# EAGLE design 2025-03-07_main_board (EAGLE 9.6.2)

## Sheet 1 of 2
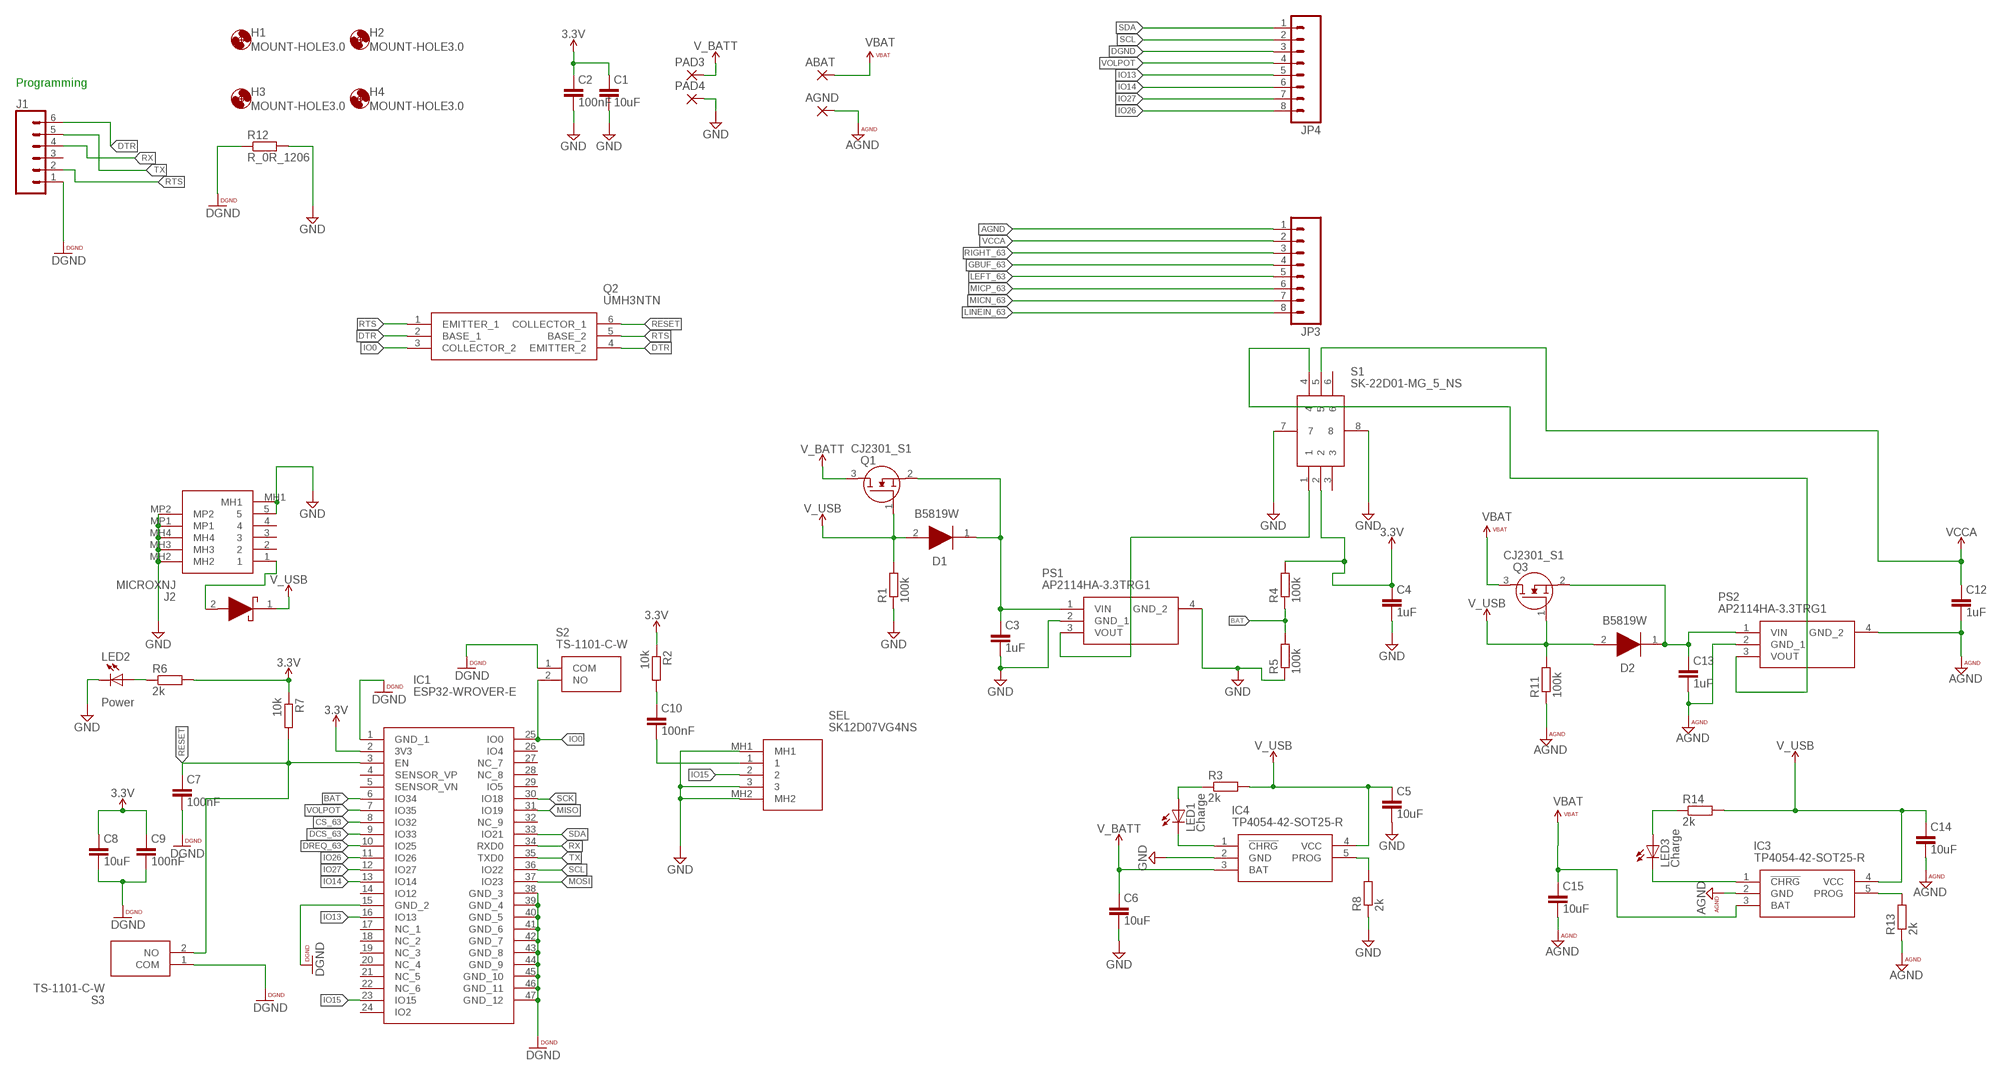
[diagram p0: schematic, sheet 1, part 1 of 2]
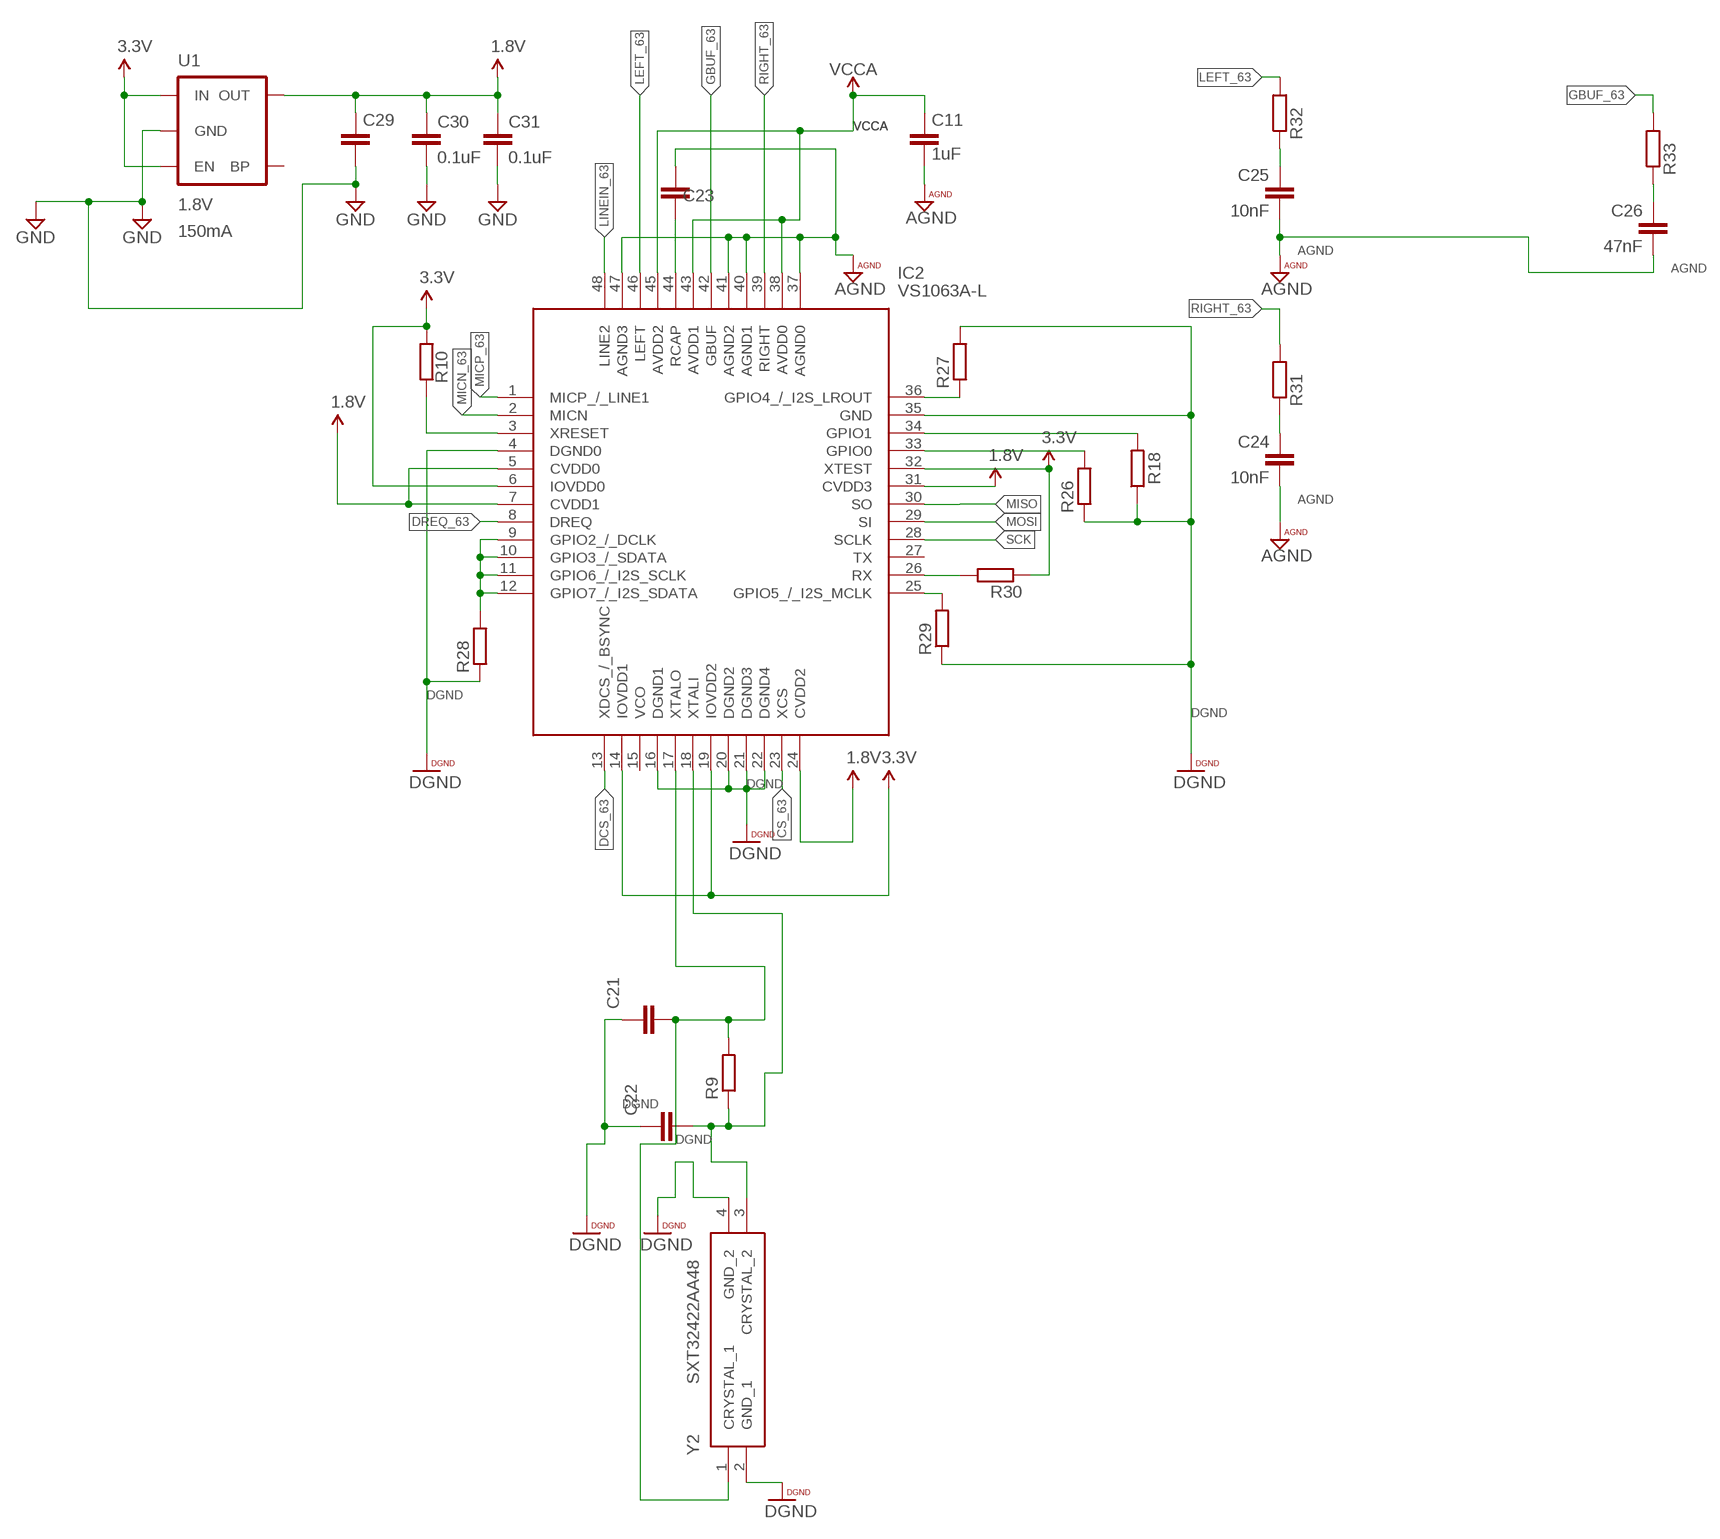
[diagram p1: schematic, sheet 1, part 2 of 2]

### Parts
ABAT  2,54/0,8  [2,54/0,8]
AGND  2,54/0,8  [2,54/0,8]
C1  10uF  C_10UF/25V_0603  [C0603]
C2  100nF  C_100NF/50V_0603  [C0603]
C3  1uF  C_1UF/25V_0402  [C0402]
C4  1uF  C_1UF/25V_0402  [C0402]
C5  10uF  C_10UF/25V_0603  [C0603]
C6  10uF  C_10UF/25V_0603  [C0603]
C7  100nF  C_100NF/50V_0603  [C0603]
C8  10uF  C_10UF/25V_0603  [C0603]
C9  100nF  C_100NF/50V_0603  [C0603]
C10  100nF  C_100NF/50V_0603  [C0603]
C11  1uF  C_1UF/25V_0402  [C0402]
C12  1uF  C_1UF/25V_0402  [C0402]
C13  1uF  C_1UF/25V_0402  [C0402]
C14  10uF  C_10UF/25V_0603  [C0603]
C15  10uF  C_10UF/25V_0603  [C0603]
C21  22pF  C_12PF/50V_0603  [C0603]
C22  22pF  C_12PF/50V_0603  [C0603]
C23  1.0uF  C_1UF/25V_0402  [C0402]
C24  10nF  10NF/10000PF-50V-10%(0603)  [0603-CAP]
C25  10nF  10NF/10000PF-50V-10%(0603)  [0603-CAP]
C26  47nF  47NF(0.047UF/47000PF)-25V-5%(0603)SMD  [0603-CAP]
C29  10uF  C_10UF/25V_0603  [C0603]
C30  0.1uF  0.1UF-25V(+80/-20%)(0603)  [0603-CAP]
C31  0.1uF  0.1UF-25V(+80/-20%)(0603)  [0603-CAP]
D1  B5819W  [SOD3716X125N]
D2  B5819W  [SOD3716X125N]
D5  BAT760-7  [SOD2513X120N]
H1  MOUNT-HOLE3.0  [3,0]
H2  MOUNT-HOLE3.0  [3,0]
H3  MOUNT-HOLE3.0  [3,0]
H4  MOUNT-HOLE3.0  [3,0]
IC1  ESP32-WROVER-E  [ESP32WROVERE]
IC2  VS1063A-L  [QFP50P900X900X160-48N]
IC3  TP4054-42-SOT25-R  [SOT95P280X100-5N]
IC4  TP4054-42-SOT25-R  [SOT95P280X100-5N]
J1  CONN_06NO_SILK_FEMALE_PTH  [1X06_NO_SILK]
J2  MICROXNJ  [MICROXNJ]
JP3  M08  [1X08_ROUND]
JP4  M08  [1X08_ROUND]
LED1  Charge  LEDCHIP-LED0603  [CHIP-LED0603]
LED2  Power  LEDCHIP-LED0603  [CHIP-LED0603]
LED3  Charge  LEDCHIP-LED0603  [CHIP-LED0603]
PAD3  2,54/0,8  [2,54/0,8]
PAD4  2,54/0,8  [2,54/0,8]
PS1  AP2114HA-3.3TRG1  [SOT230P700X180-4N]
PS2  AP2114HA-3.3TRG1  [SOT230P700X180-4N]
Q1  CJ2301_S1  [SOT95P240X115-3N]
Q2  UMH3NTN  [UMH3NTN]
Q3  CJ2301_S1  [SOT95P240X115-3N]
R1  100k  R_100K_0603  [R0603]
R2  10k  R_10K_0603  [R0603]
R3  2k  R_2K_0603  [R0603]
R4  100k  R_100K_0603  [R0603]
R5  100k  R_100K_0603  [R0603]
R6  2k  R_2K_0603  [R0603]
R7  10k  R_10K_0603  [R0603]
R8  2k  R_2K_0603  [R0603]
R9  1M  R_1M_0603  [R0603]
R10  100k  R_100K_0603  [R0603]
R11  100k  R_100K_0603  [R0603]
R12  R_0R_1206  [R1206]
R13  2k  R_2K_0603  [R0603]
R14  2k  R_2K_0603  [R0603]
R18  100k  R_100K_0603  [R0603]
R26  100k  R_100K_0603  [R0603]
R27  100k  R_100K_0603  [R0603]
R28  100k  R_100K_0603  [R0603]
R29  100k  R_100K_0603  [R0603]
R30  100k  R_100K_0603  [R0603]
R31  20  R_20R_0603  [R0603]
R32  20  R_20R_0603  [R0603]
R33  10  R_10R_0603  [R0603]
S1  SK-22D01-MG_5_NS  [SK22D01MG5NS]
S2  TS-1101-C-W  [TS1101CW]
S3  TS-1101-C-W  [TS1101CW]
SEL  SK12D07VG4NS  [SK12D07VG4NS]
U1  1.8V  V_REG_SP62141.8V  [SC70]
Y2  SXT32422AA48  [SXT32422AA48]

### Nets
1.8V: C29.1 C30.1 C31.1 IC2.5(CVDD0) IC2.7(CVDD1) IC2.24(CVDD2) IC2.31(CVDD3) U1.5(OUT)
3.3V: C1.1 C2.1 C4.1 C8.1 C9.1 IC1.2(3V3) IC2.6(IOVDD0) IC2.14(IOVDD1) IC2.19(IOVDD2) IC2.32(XTEST) R2.1 R4.2 R6.2 R7.1 R10.2 R30.1 S1.2 U1.1(IN) U1.3(EN)
AGND: AGND.1(P) C11.2 C12.2 C13.2 C14.2 C15.2 C23.2 C24.2 C25.2 C26.2 IC2.37(AGND0) IC2.40(AGND1) IC2.41(AGND2) IC2.47(AGND3) IC3.2(GND) JP3.1 PS2.2(GND_1) PS2.4(GND_2) R11.1 R13.1
BAT: IC1.6(IO34) R4.1 R5.2
CS_63: IC1.8(IO32) IC2.23(XCS)
DCS_63: IC1.9(IO33) IC2.13(XDCS_/_BSYNC)
DGND: C7.2 C8.2 C9.2 C21.1 C22.1 IC1.1(GND_1) IC1.15(GND_2) IC1.38(GND_3) IC1.39(GND_4) IC1.40(GND_5) IC1.41(GND_6) IC1.42(GND_7) IC1.43(GND_8) IC1.44(GND_9) IC1.45(GND_10) IC1.46(GND_11) IC1.47(GND_12) IC2.4(DGND0) IC2.16(DGND1) IC2.20(DGND2) IC2.21(DGND3) IC2.22(DGND4) IC2.35(GND) J1.1 JP4.3 R12.1 R18.1 R26.1 R27.2 R28.1 R29.1 S2.1(COM) S3.1(COM) Y2.2(GND_1) Y2.4(GND_2)
DREQ_63: IC1.10(IO25) IC2.8(DREQ)
DTR: J1.6 Q2.2(BASE_1) Q2.4(EMITTER_2)
GBUF_63: IC2.42(GBUF) JP3.4 R33.2
GND: C1.2 C2.2 C3.2 C4.2 C5.2 C6.2 C29.2 C30.2 C31.2 IC4.2(GND) J2.5 J2.MH1 J2.MH2 J2.MH3 J2.MH4 J2.MP1 J2.MP2 LED2.C PAD4.1(P) PS1.2(GND_1) PS1.4(GND_2) R1.1 R5.1 R8.1 R12.2 S1.7 S1.8 SEL.3 SEL.MH1 SEL.MH2 U1.2(GND)
IO0: IC1.25(IO0) Q2.3(COLLECTOR_2) S2.2(NO)
IO13: IC1.16(IO13) JP4.5
IO14: IC1.13(IO14) JP4.6
IO15: IC1.23(IO15) SEL.2
IO26: IC1.11(IO26) JP4.8
IO27: IC1.12(IO27) JP4.7
LEFT_63: IC2.46(LEFT) JP3.5 R32.2
LINEIN_63: IC2.48(LINE2) JP3.8
MICN_63: IC2.2(MICN) JP3.7
MICP_63: IC2.1(MICP_/_LINE1) JP3.6
MISO: IC1.31(IO19) IC2.30(SO)
MOSI: IC1.37(IO23) IC2.29(SI)
N$1: PS1.3(VOUT) S1.1
N$2: C3.1 D1.1(K) PS1.1(VIN) Q1.2(S)
N$3: LED2.A R6.1
N$4: IC4.1(!CHRG) LED1.C
N$5: LED1.A R3.1
N$6: D5.2(A) J2.1
N$7: IC4.5(PROG) R8.2
N$8: C13.1 D2.1(K) PS2.1(VIN) Q3.2(S)
N$9: C10.1 R2.2
N$10: C10.2 SEL.1
N$11: IC2.3(XRESET) R10.1
N$12: IC2.34(GPIO1) R18.2
N$14: IC3.1(!CHRG) LED3.C
N$16: LED3.A R14.1
N$17: PS2.3(VOUT) S1.4
N$20: C21.2 IC2.17(XTALO) R9.2 Y2.1(CRYSTAL_1)
N$21: IC2.36(GPIO4_/_I2S_LROUT) R27.1
N$22: IC2.33(GPIO0) R26.2
N$23: C22.2 IC2.18(XTALI) R9.1 Y2.3(CRYSTAL_2)
N$24: C23.1 IC2.44(RCAP)
N$25: IC2.25(GPIO5_/_I2S_MCLK) R29.2
N$26: IC3.5(PROG) R13.2
N$27: IC2.9(GPIO2_/_DCLK) IC2.10(GPIO3_/_SDATA) IC2.11(GPIO6_/_I2S_SCLK) IC2.12(GPIO7_/_I2S_SDATA) R28.2
N$28: IC2.26(RX) R30.2
N$30: C26.1 R33.1
N$31: C25.1 R32.1
N$32: C24.1 R31.1
RESET: C7.1 IC1.3(EN) Q2.6(COLLECTOR_1) R7.2 S3.2(NO)
RIGHT_63: IC2.39(RIGHT) JP3.3 R31.2
RTS: J1.2 Q2.1(EMITTER_1) Q2.5(BASE_2)
RX: IC1.34(RXD0) J1.4
SCK: IC1.30(IO18) IC2.28(SCLK)
SCL: IC1.36(IO22) JP4.2
SDA: IC1.33(IO21) JP4.1
TX: IC1.35(TXD0) J1.5
V_BATT: C6.1 IC4.3(BAT) PAD3.1(P) Q1.3(D)
V_USB: C5.1 C14.1 D1.2(A) D2.2(A) D5.1(K) IC3.4(VCC) IC4.4(VCC) Q1.1(G) Q3.1(G) R1.2 R3.2 R11.2 R14.2
VBAT: ABAT.1(P) C15.1 IC3.3(BAT) Q3.3(D)
VCCA: C11.1 C12.1 IC2.38(AVDD0) IC2.43(AVDD1) IC2.45(AVDD2) JP3.2 S1.5
VOLPOT: IC1.7(IO35) JP4.4
Unconnected: IC1.4(SENSOR_VP) IC1.5(SENSOR_VN) IC1.14(IO12) IC1.17(NC_1) IC1.18(NC_2) IC1.19(NC_3) IC1.20(NC_4) IC1.21(NC_5) IC1.22(NC_6) IC1.24(IO2) IC1.26(IO4) IC1.27(NC_7) IC1.28(NC_8) IC1.29(IO5) IC1.32(NC_9) IC2.15(VCO) IC2.27(TX) J1.3 J2.2 J2.3 J2.4 S1.3 S1.6 U1.4(BP)

### Notes on the sheet
- Programming
- 150mA

## Sheet 2 of 2

## Library data of the parts
ABAT AGND PAD3 PAD4 = wirepad:2,54/0,8: THROUGH-HOLE PAD
C1 C5 C6 C8 C14 C15 C29 = JLC PCB Basic Parts_loc:C_: Capacitor General purpose SMD Capacitor; LCSC_DATASHEET: https://datasheet.lcsc.com/lcsc/1811110921_Samsung-Electro-Mechanics-CL10A106MA8NRNC_C96446.pdf; LCSC_PART: C96446; LCSC_ROTATION_CCW: 0; LCSC_STOCK: 119091; PROPERTIES: X5R 25V ±20% 10uF 0603 ROHS
C2 C7 C9 C10 = JLC PCB Basic Parts_loc:C_: Capacitor General purpose SMD Capacitor; LCSC_DATASHEET: https://datasheet.lcsc.com/lcsc/1809301912_YAGEO-CC0603KRX7R9BB104_C14663.pdf; LCSC_PART: C14663; LCSC_ROTATION_CCW: 0; LCSC_STOCK: 7111530; PROPERTIES: 50V 100nF X7R ±10% 0603 ROHS
C3 C4 C11-C13 C23 = JLC PCB Basic Parts_loc:C_: Capacitor General purpose SMD Capacitor; LCSC_DATASHEET: https://datasheet.lcsc.com/lcsc/1811091611_Samsung-Electro-Mechanics-CL05A105KA5NQNC_C52923.pdf; LCSC_PART: C52923; LCSC_ROTATION_CCW: 0; LCSC_STOCK: 6404174; PROPERTIES: 25V 1uF X5R ±10% 0402 ROHS
C21 C22 = JLC PCB Basic Parts_loc:C_: Capacitor General purpose SMD Capacitor; LCSC_DATASHEET: https://datasheet.lcsc.com/lcsc/1810261515_Samsung-Electro-Mechanics-CL10C120JB8NNNC_C38523.pdf; LCSC_PART: C38523; LCSC_ROTATION_CCW: 0; LCSC_STOCK: 87030; PROPERTIES: 50V 12pF C0G ±5% 0603 ROHS
C24 C25 = SparkFun-Capacitors:10NF/10000PF-50V-10%(0603): CAP-00867; PROD_ID: CAP-00867
C26 = SparkFun-Capacitors:47NF(0.047UF/47000PF)-25V-5%(0603): CAP-08605; PROD_ID: CAP-08605
C30 C31 = SparkFun-Capacitors:0.1UF-25V(+80/-20%)(0603): CAP-00810 Ceramic Standard decoupling cap; PROD_ID: CAP-00810
D1 D2 = B5819W:B5819W: 40V 1A 600mV @ 1A SOD-123 Schottky Barrier Diodes (SBD) Source: Datasheet; DESCRIPTION: 40V 1A 600mV @ 1A SOD-123 Schottky Barrier Diodes (SBD); HEIGHT: 1.25mm; MANUFACTURER_NAME: Changjiang Electronics Tech (CJ); MANUFACTURER_PART_NUMBER: B5819W
D5 = BAT760-7:BAT760-7: Diode Schottky 30V 1A 2Pin SOD323 Diodes Inc BAT760-7, SMT Schottky Diode, 30V 1A, 2-Pin SOD-323 Source: Datasheet; ARROW_PART_NUMBER: BAT760-7; ARROW_PRICE-STOCK: https://www.arrow.com/en/products/bat760-7/diodes-incorporated?region=europe; DESCRIPTION: Diode Schottky 30V 1A 2Pin SOD323 Diodes Inc BAT760-7, SMT Schottky Diode, 30V 1A, 2-Pin SOD-323; HEIGHT: 1.2mm; MANUFACTURER_NAME: Diodes Inc.; MANUFACTURER_PART_NUMBER: BAT760-7; MOUSER_PART_NUMBER: 621-BAT760-7; MOUSER_PRICE-STOCK: https://www.mouser.co.uk/ProductDetail/Diodes-Incorporated/BAT760-7?qs=JV7lzlMm3yKDDyO09xoRbQ%3D%3D
H1-H4 = holes:MOUNT-HOLE: MOUNTING HOLE with drill center marker
IC1 = ESP32-WROVER-E:ESP32-WROVER-E: Module: IoT; Bluetooth Low Energy,WiFi; PCB; SMD; 18x31.4x3.3mm Source: Datasheet; DESCRIPTION: Module: IoT; Bluetooth Low Energy,WiFi; PCB; SMD; 18x31.4x3.3mm; HEIGHT: 3.45mm; MANUFACTURER_NAME: Espressif Systems; MANUFACTURER_PART_NUMBER: ESP32-WROVER-E
IC2 = VS1063A-L:VS1063A-L: VS1063 - MP3 / Ogg Vorbis Encoder and Audio Codec Circuit, LQFP48 7x7x1.4mm Source: Datasheet; DESCRIPTION: VS1063 - MP3 / Ogg Vorbis Encoder and Audio Codec Circuit, LQFP48 7x7x1.4mm; HEIGHT: 1.6mm; MANUFACTURER_NAME: VLSI; MANUFACTURER_PART_NUMBER: VS1063A-L
IC3 IC4 = TP4054-42-SOT25-R:TP4054-42-SOT25-R: Standalone Linear Li-ion Battery Charger with Thermal Regulation, SOT-23-5 Source: Datasheet; DESCRIPTION: Standalone Linear Li-ion Battery Charger with Thermal Regulation, SOT-23-5; HEIGHT: 1mm; MANUFACTURER_NAME: TOP POWER; MANUFACTURER_PART_NUMBER: TP4054-42-SOT25-R
J1 = SparkFun-Connectors:CONN_06: Multi connection point. Often used as Generic Header-pin footprint for 0.1 inch spaced/style header connections On any of the 0.1 inch spaced packages, you can populate with these: Break Away Headers - Straight (PRT-00116) Break Away Male Headers - Right Angle (PRT-00553) Female Headers (PRT-00115) Break Away Headers - Machine Pin (PRT-00117) Break Away Female Headers - Swiss Machine Pin (PRT-00743) Arduino Stackable Header - 6 Pin (PRT-09280) For SCREWTERMINALS and SPRING TERMINALS visit here: Screw Terimnals on SparkFun.com (5mm/3.5mm/2.54mm spacing) This device is also useful as a general connection point to wire up your design to another part of your project. Our various solder wires solder well into these plated through hole pads. Hook-Up Wire - Assortment (Stranded, 22 AWG) (PRT-11375) Hook-Up Wire - Assortment (Solid Core, 22 AWG) (PRT-11367) View the entire wire category on our website here; PROD_ID: CONN-08437
J2 = MICROXNJ:MICROXNJ: MICRO-USB-SMD_MICROXNJ Source: Datasheet; DESCRIPTION: MICRO-USB-SMD_MICROXNJ; HEIGHT: 2.425mm; MANUFACTURER_NAME: Shou Han; MANUFACTURER_PART_NUMBER: MICROXNJ
JP3 JP4 = PatternAgents-ProtoPads:M08: Header 8 Standard 8-pin 0.1" header
LED1-LED3 = adafruit:LED: LED OSRAM: - CHIPLED LG R971, LG N971, LY N971, LG Q971, LY Q971, LO R971, LY R971 LH N974, LH R974 LS Q976, LO Q976, LY Q976 LO Q996 - Hyper CHIPLED LW Q18S LB Q993, LB Q99A, LB R99A - SideLED LS A670, LO A670, LY A670, LG A670, LP A670 LB A673, LV A673, LT A673, LW A673 LH A674 LY A675 LS A676, LA A676, LO A676, LY A676, LW A676 LS A679, LY A679, LG A679 - Hyper Micro SIDELED® LS Y876, LA Y876, LO Y876, LY Y876 LT Y87S - SmartLED LW L88C, LW L88S LB L89C, LB L89S, LG L890 LS L89K, LO L89K, LY L89K LS L896, LA L896, LO L896, LY L896 - TOPLED LS T670, LO T670, LY T670, LG T670, LP T670 LSG T670, LSP T670, LSY T670, LOP T670, LYG T670 LG T671, LOG T671, LSG T671 LB T673, LV T673, LT T673, LW T673 LH T674 LS T676, LA T676, LO T676, LY T676, LB T676, LH T676, LSB T676, LW T676 LB T67C, LV T67C, LT T67C, LS T67K, LO T67K, LY T67K, LW E67C LS E67B, LA E67B, LO E67B, LY E67B, LB E67C, LV E67C, LT E67C LW T67C LS T679, LY T679, LG T679 LS T770, LO T770, LY T770, LG T770, LP T770 LB T773, LV T773, LT T773, LW T773 LH T774 LS E675, LA E675, LY E675, LS T675 LS T776, LA T776, LO T776, LY T776, LB T776 LHGB T686 LT T68C, LB T68C - Hyper Mini TOPLED® LB M676 - Mini TOPLED Santana® LG M470 LS M47K, LO M47K, LY M47K Source: http://www.osram.convergy.de/
PS1 PS2 = AP2114HA-3.3TRG1:AP2114HA-3.3TRG1: LDO Voltage Regulators 1A LN CMOS LDO 0.45V 60uA 50mA Source: Datasheet; ARROW_PART_NUMBER: AP2114HA-3.3TRG1; ARROW_PRICE-STOCK: https://www.arrow.com/en/products/ap2114ha-3.3trg1/diodes-incorporated; DESCRIPTION: LDO Voltage Regulators 1A LN CMOS LDO 0.45V 60uA 50mA; HEIGHT: 1.8mm; MANUFACTURER_NAME: Diodes Inc.; MANUFACTURER_PART_NUMBER: AP2114HA-3.3TRG1; MOUSER_PART_NUMBER: 621-AP2114HA-3.3TRG1; MOUSER_PRICE-STOCK: https://www.mouser.co.uk/ProductDetail/Diodes-Incorporated/AP2114HA-33TRG1?qs=M%2FOdCRO8QQ3KWhA9Gt6VoQ%3D%3D
Q1 Q3 = CJ2301_S1:CJ2301_S1: MOSFET P Trench 20V 2.3A 1V @ 250uA 112 m @ 2.8A,4.5V SOT-23(SOT-23-3) RoHS Source: Datasheet; DESCRIPTION: MOSFET P Trench 20V 2.3A 1V @ 250uA 112 m @ 2.8A,4.5V SOT-23(SOT-23-3) RoHS; HEIGHT: 1.15mm; MANUFACTURER_NAME: Changjiang Electronics Tech (CJ); MANUFACTURER_PART_NUMBER: CJ2301 S1
Q2 = UMH3NTN:UMH3NTN: Bipolar Transistors - Pre-Biased DUAL NPN 50V 100MA SOT-363 Source: Datasheet; ARROW_PART_NUMBER: UMH3NTN; ARROW_PRICE-STOCK: https://www.arrow.com/en/products/umh3ntn/rohm-semiconductor?region=nac; DESCRIPTION: Bipolar Transistors - Pre-Biased DUAL NPN 50V 100MA SOT-363; HEIGHT: 1mm; MANUFACTURER_NAME: ROHM Semiconductor; MANUFACTURER_PART_NUMBER: UMH3NTN; MOUSER_PART_NUMBER: 755-UMH3NTN; MOUSER_PRICE-STOCK: https://www.mouser.co.uk/ProductDetail/ROHM-Semiconductor/UMH3NTN?qs=4kLU8WoGk0st6ahJ6z2bmw%3D%3D
R1 R4 R5 R10 R11 R18 R26-R30 = JLC PCB Basic Parts_loc:R_: Resistor General purpose SMD Resistor; LCSC_DATASHEET: https://datasheet.lcsc.com/lcsc/2110260030_UNI-ROYAL-Uniroyal-Elec-0603WAF1003T5E_C25803.pdf; LCSC_PART: C25803; LCSC_ROTATION_CCW: 0; LCSC_STOCK: 5826279; PROPERTIES: ±1% 1/10W Thick Film Resistors 75V ±100ppm -55°C~+155°C 100kOhm 0603 ROHS
R2 R7 = JLC PCB Basic Parts_loc:R_: Resistor General purpose SMD Resistor; LCSC_DATASHEET: https://datasheet.lcsc.com/lcsc/2110260030_UNI-ROYAL-Uniroyal-Elec-0603WAF1002T5E_C25804.pdf; LCSC_PART: C25804; LCSC_ROTATION_CCW: 0; LCSC_STOCK: 7979018; PROPERTIES: ±1% 1/10W Thick Film Resistors 75V ±100ppm -55°C~+155°C 10kOhm 0603 ROHS
R3 R6 R8 R13 R14 = JLC PCB Basic Parts_loc:R_: Resistor General purpose SMD Resistor; LCSC_DATASHEET: https://datasheet.lcsc.com/lcsc/2110252130_UNI-ROYAL-Uniroyal-Elec-0603WAF2001T5E_C22975.pdf; LCSC_PART: C22975; LCSC_ROTATION_CCW: 0; LCSC_STOCK: 3372290; PROPERTIES: ±1% 1/10W Thick Film Resistors 75V ±100ppm -55°C~+155°C 2kOhm 0603 ROHS
R9 = JLC PCB Basic Parts_loc:R_: Resistor General purpose SMD Resistor; LCSC_DATASHEET: https://datasheet.lcsc.com/lcsc/2110252030_UNI-ROYAL-Uniroyal-Elec-0603WAF1004T5E_C22935.pdf; LCSC_PART: C22935; LCSC_ROTATION_CCW: 0; LCSC_STOCK: 1411723; PROPERTIES: ±1% 1/10W Thick Film Resistors 75V ±100ppm -55°C~+155°C 1MOhm 0603 ROHS
R12 = JLC PCB Basic Parts_loc:R_: Resistor General purpose SMD Resistor; LCSC_DATASHEET: https://datasheet.lcsc.com/lcsc/2110251930_UNI-ROYAL-Uniroyal-Elec-1206W4F0000T5E_C17888.pdf; LCSC_PART: C17888; LCSC_ROTATION_CCW: 0; LCSC_STOCK: 399166; PROPERTIES: ±1% 250mW Thick Film Resistors 200V ±800ppm -55°C~+155°C 0Ohm 1206 ROHS
R31 R32 = JLC PCB Basic Parts_loc:R_: Resistor General purpose SMD Resistor; LCSC_DATASHEET: https://datasheet.lcsc.com/lcsc/2110252030_UNI-ROYAL-Uniroyal-Elec-0603WAF200JT5E_C22950.pdf; LCSC_PART: C22950; LCSC_ROTATION_CCW: 0; LCSC_STOCK: 40713; PROPERTIES: ±1% 1/10W Thick Film Resistors 75V ±100ppm -55°C~+155°C 20Ohm 0603 ROHS
R33 = JLC PCB Basic Parts_loc:R_: Resistor General purpose SMD Resistor; LCSC_DATASHEET: https://datasheet.lcsc.com/lcsc/2110252030_UNI-ROYAL-Uniroyal-Elec-0603WAF100JT5E_C22859.pdf; LCSC_PART: C22859; LCSC_ROTATION_CCW: 0; LCSC_STOCK: 2733989; PROPERTIES: ±1% 1/10W Thick Film Resistors 75V ±400ppm -55°C~+155°C 10Ohm 0603 ROHS
S1 = SK-22D01-MG_5_NS:SK-22D01-MG_5_NS: Slide Switches DPDT 0.3 Amp at 30 V Source: Datasheet; ARROW_PART_NUMBER: SK-22D01-MG 5 NS; ARROW_PRICE-STOCK: https://www.arrow.com/en/products/sk22d01mg5ns/ck?region=nac; DESCRIPTION: Slide Switches DPDT 0.3 Amp at 30 V; HEIGHT: 5.1mm; MANUFACTURER_NAME: C & K COMPONENTS; MANUFACTURER_PART_NUMBER: SK-22D01-MG 5 NS; MOUSER_PART_NUMBER: 611-SK-22D01-MG5NS; MOUSER_PRICE-STOCK: https://www.mouser.co.uk/ProductDetail/CK/SK-22D01-MG-5-NS?qs=T%252BgPUmif8%252Bj%2Ffo3NJcSFGw%3D%3D
S2 S3 = TS-1101-C-W:TS-1101-C-W: tact switch 3x6x2.5 stick flat foot white button 260GF Source: Datasheet; DESCRIPTION: tact switch 3x6x2.5 stick flat foot white button 260GF; HEIGHT: 2.6mm; MANUFACTURER_NAME: XKB Connectivity; MANUFACTURER_PART_NUMBER: TS-1101-C-W
SEL = SK12D07VG4NS:SK12D07VG4NS: Slide Switch SPDT Through Hole, Right Angle Source: Datasheet; DESCRIPTION: Slide Switch SPDT Through Hole, Right Angle; HEIGHT: 4.7mm; MANUFACTURER_NAME: C & K COMPONENTS; MANUFACTURER_PART_NUMBER: SK12D07VG4NS; MOUSER_PART_NUMBER: 611-SK12D07VG4NS; MOUSER_PRICE-STOCK: https://www.mouser.co.uk/ProductDetail/CK/SK12D07VG4NS?qs=%252BAZVS4b%2FkgLd%252BNbIV7hYcQ%3D%3D
U1 = SparkFun-PowerIC:V_REG_SP6214; PROD_ID: VREG-08428; VALUE: 1.8V/100mA
Y2 = SXT32422AA48:SXT32422AA48: 32MHz +/-50ppm Crystal 22pF 40 Ohms 4-SMD, No Lead Source: Datasheet; DESCRIPTION: 32MHz +/-50ppm Crystal 22pF 40 Ohms 4-SMD, No Lead; HEIGHT: 0.8mm; MANUFACTURER_NAME: Suntsu; MANUFACTURER_PART_NUMBER: SXT32422AA48

## Board
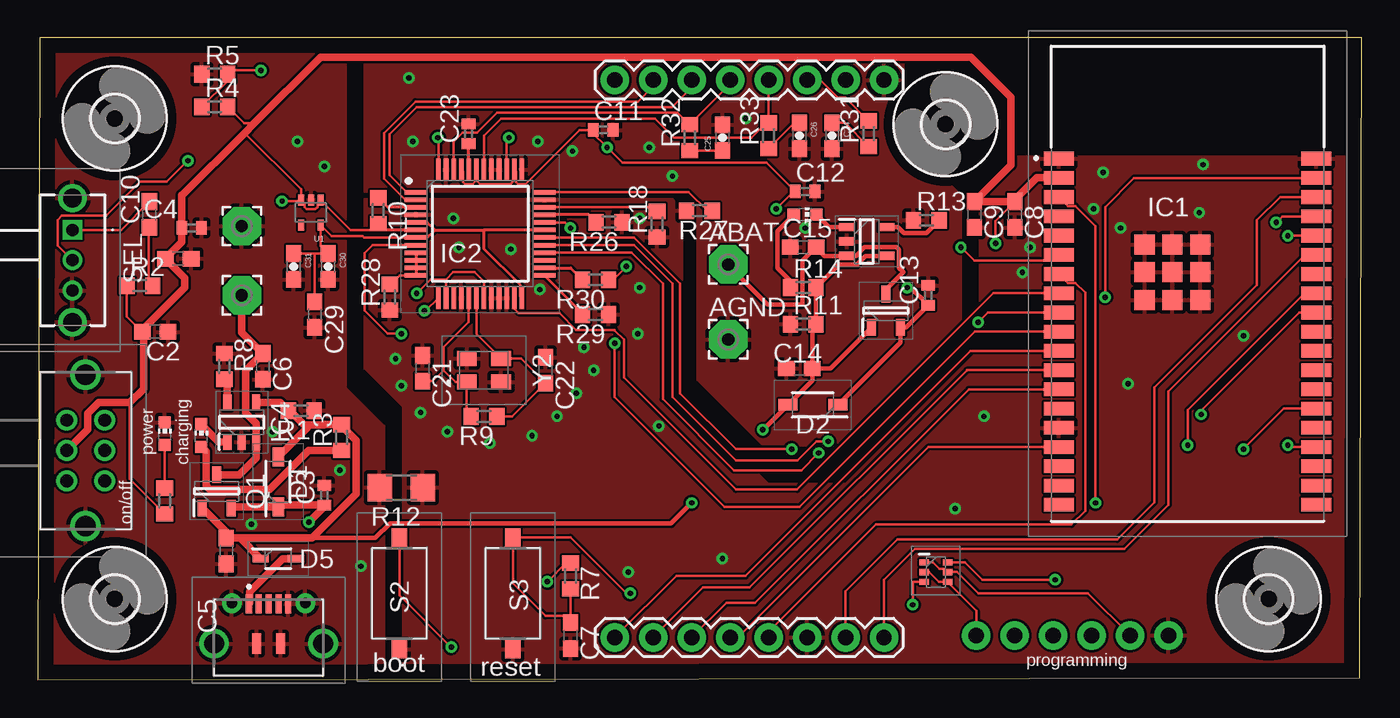
[diagram p2: board, top side]
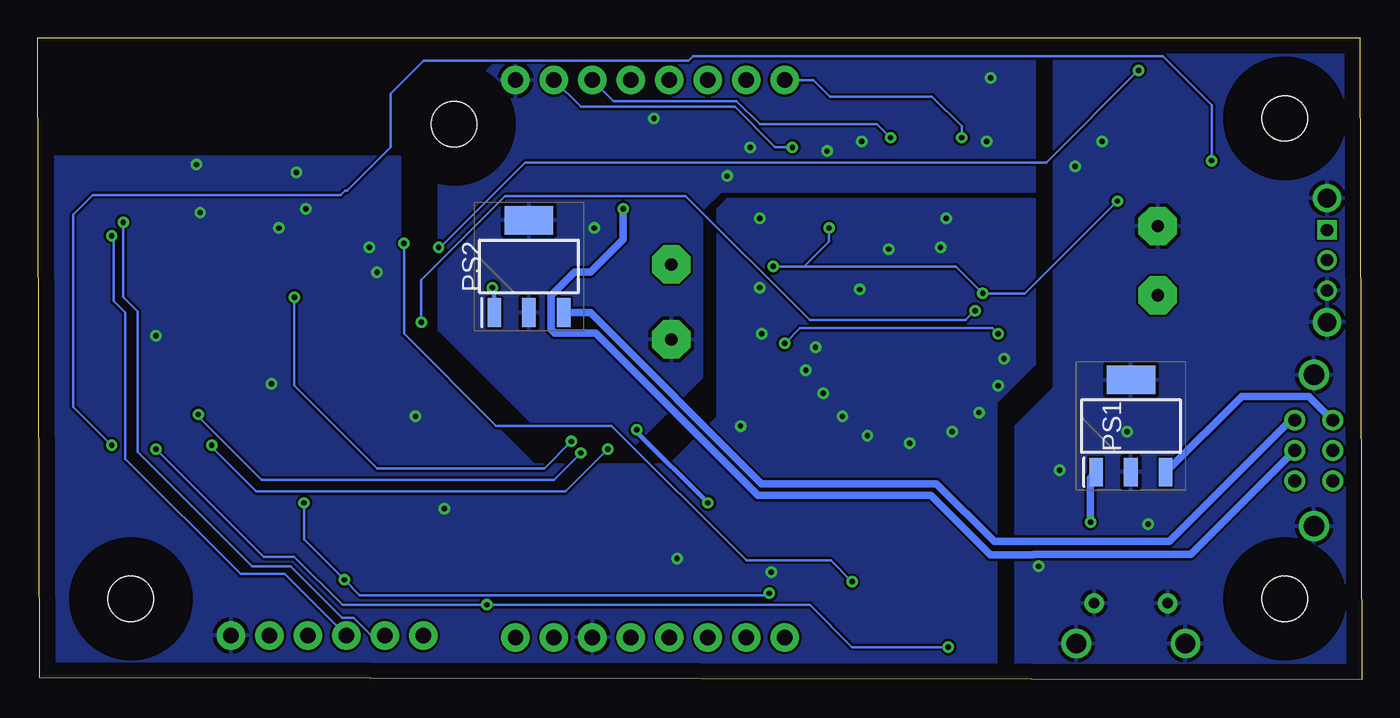
[diagram p3: board, bottom side, seen from below]

Size 87.43 x 42.41 mm. Coordinates in mm from the lower left corner, seen from the top.
Outline: 0,0 87.3,0.13 87.43,42.41 0.13,42.41 0,0
Copper layers (1*16): Top 0.035mm / dielectric 1.5mm / Bottom 0.035mm
Design rules "default": minimum track width 6mil, minimum drill 0.35mm, track to track 6mil, track to pad 6mil, pad to pad 6mil, via to via 6mil, smd to smd 6mil, copper to edge 40mil, drill to drill 6mil, minimum pad ring 10mil, minimum via ring 8mil, stop-mask expansion 4mil, vias tented up to drill 0mil, thermal gap 10mil

### Footprints (pad centres in the part's own frame; a part is rotated, then mirrored left to right if it is on the bottom)
2,54/0,8 = drill 0.813 pad 2.54 octagon: 1 0,0
C0603 = smd 1.1 x 1: 1 -0.85,0; 2 0.85,0
C0402 = smd 0.7 x 0.9: 1 -0.65,0; 2 0.65,0
0603-CAP = smd 1.1 x 1: 1 -0.85,0; 2 0.85,0
SOD3716X125N = smd 1.25 x 0.75: 1 -1.65,0; 2 1.65,0
SOD2513X120N = smd 1.075 x 0.5: 1 -1.162,0; 2 1.162,0
3,0 = hole 3: 0,0
ESP32WROVERE = smd 2 x 0.9: 1 -7.5,7.5; 2 -7.5,6.23; 3 -7.5,4.96; 4 -7.5,3.69; 5 -7.5,2.42; 6 -7.5,1.15; 7 -7.5,-0.12; 8 -7.5,-1.39; 9 -7.5,-2.66; 10 -7.5,-3.93; 11 -7.5,-5.2; 12 -7.5,-6.47; 13 -7.5,-7.74; 14 -7.5,-9.01; 15 -7.5,-10.28; 16 -7.5,-11.55; 17 -7.5,-12.82; 18 -7.5,-14.09; 19 -7.5,-15.36; 20 9.5,-15.36; 21 9.5,-14.09; 22 9.5,-12.82; 23 9.5,-11.55; 24 9.5,-10.28; 25 9.5,-9.01; 26 9.5,-7.74; 27 9.5,-6.47; 28 9.5,-5.2; 29 9.5,-3.93; 30 9.5,-2.66; 31 9.5,-1.39; 32 9.5,-0.12; 33 9.5,1.15; 34 9.5,2.42; 35 9.5,3.69; 36 9.5,4.96; 37 9.5,6.23; 38 9.5,7.5 | smd 1.33 x 1.33: 39 0,0; 40 -1.835,1.835; 41 -1.835,0; 42 -1.835,-1.835; 43 0,-1.835; 44 1.835,-1.835; 45 1.835,0; 46 1.835,1.835; 47 0,1.835
QFP50P900X900X160-48N = smd 1.475 x 0.3: 1 -4.238,2.75; 2 -4.238,2.25; 3 -4.238,1.75; 4 -4.238,1.25; 5 -4.238,0.75; 6 -4.238,0.25; 7 -4.238,-0.25; 8 -4.238,-0.75; 9 -4.238,-1.25; 10 -4.238,-1.75; 11 -4.238,-2.25; 12 -4.238,-2.75; 25 4.238,-2.75; 26 4.238,-2.25; 27 4.238,-1.75; 28 4.238,-1.25; 29 4.238,-0.75; 30 4.238,-0.25; 31 4.238,0.25; 32 4.238,0.75; 33 4.238,1.25; 34 4.238,1.75; 35 4.238,2.25; 36 4.238,2.75 | smd 0.3 x 1.475: 13 -2.75,-4.238; 14 -2.25,-4.238; 15 -1.75,-4.238; 16 -1.25,-4.238; 17 -0.75,-4.238; 18 -0.25,-4.238; 19 0.25,-4.238; 20 0.75,-4.238; 21 1.25,-4.238; 22 1.75,-4.238; 23 2.25,-4.238; 24 2.75,-4.238; 37 2.75,4.238; 38 2.25,4.238; 39 1.75,4.238; 40 1.25,4.238; 41 0.75,4.238; 42 0.25,4.238; 43 -0.25,4.238; 44 -0.75,4.238; 45 -1.25,4.238; 46 -1.75,4.238; 47 -2.25,4.238; 48 -2.75,4.238
SOT95P280X100-5N = smd 1.05 x 0.55: 1 -1.3,0.95; 2 -1.3,0; 3 -1.3,-0.95; 4 1.3,-0.95; 5 1.3,0.95
1X06_NO_SILK = drill 1.016 pad 1.88: 1 0,0; 2 2.54,0; 3 5.08,0; 4 7.62,0; 5 10.16,0; 6 12.7,0
MICROXNJ = smd 0.4 x 1.25: 1 1.3,-4.775; 2 0.65,-4.775; 3 0,-4.775; 4 -0.65,-4.775; 5 -1.3,-4.775 | drill 0.7 pad 1.3: MH1 2.425,-4.8; MH2 -2.425,-4.8 | drill 1.3 pad 1.9: MH3 3.6,-2.13; MH4 -3.6,-2.13 | smd 0.6 x 1.35: MP1 0.8,-2.125; MP2 -0.8,-2.125
1X08_ROUND = drill 1.016 pad 1.88: 1 0,0; 2 2.54,0; 3 5.08,0; 4 7.62,0; 5 10.16,0; 6 12.7,0; 7 15.24,0; 8 17.78,0
CHIP-LED0603 = smd 0.8 x 0.8: A 0,-0.75; C 0,0.75
SOT230P700X180-4N = smd 1.9 x 0.9: 1 -3.05,2.3; 2 -3.05,0; 3 -3.05,-2.3 | smd 1.9 x 3.2: 4 3.05,0
SOT95P240X115-3N = smd 1.1 x 0.6: 1 -1.1,0.95; 2 -1.1,-0.95; 3 1.1,0
UMH3NTN = smd 0.65 x 0.4: 1 -0.775,0.65; 2 -0.775,0; 3 -0.775,-0.65; 4 0.775,-0.65; 5 0.775,0; 6 0.775,0.65
R0603 = smd 1 x 1.1: 1 -0.85,0; 2 0.85,0
R1206 = smd 1.6 x 1.803: 1 -1.422,0; 2 1.422,0
SK22D01MG5NS = drill 0.85 pad 1.381: 1 0,0; 2 2,0; 3 4,0; 4 0,2.5; 5 2,2.5; 6 4,2.5 | drill 1.35 pad 2.025: 7 -3,1.25; 8 7,1.25
TS1101CW = smd 1.2 x 1: 1 -3.7,0; 2 3.7,0
SK12D07VG4NS = drill 0.8 pad 1.3 square: 1 0,0 | drill 0.8 pad 1.3: 2 2,0; 3 4,0 | drill 1.25 pad 1.875: MH1 -2.1,0; MH2 6.1,0
SC70 = smd 0.4 x 0.75: 1 -0.65,-0.825; 2 0,-0.825; 3 0.65,-0.825; 4 0.65,0.825; 5 -0.65,0.825
SXT32422AA48 = smd 1 x 1.3: 1 -0.775,1.125; 2 -0.775,-1.125; 3 0.775,-1.125; 4 0.775,1.125

### Placement (x,y rotation side)
ABAT  45.59,27.43 0 top
AGND  45.59,22.48 0 top
C1  9.27,27.81 0 top
C2  7.75,22.99 0 top
C3  18.92,12.19 90 top
C4  10.16,29.85 0 top
C5  12.45,8.51 270 top
C6  14.86,20.7 270 top
C7  35.18,2.92 270 top
C8  64.52,30.73 270 top
C9  61.85,30.73 270 top
C10  7.37,30.73 90 top
C11  37.34,36.32 0 top
C12  50.67,32.26 0 top
C13  58.8,25.4 90 top
C14  50.29,20.57 180 top
C15  50.55,28.58 180 top
C21  25.4,20.57 270 top
C22  33.53,20.45 270 top
C23  28.45,36.07 90 top
C24  52.45,35.94 270 top
C25  45.21,35.81 90 top
C26  50.29,35.94 270 top
C29  18.29,24.13 270 top
C30  19.18,27.3 270 top
C31  16.89,27.3 270 top
D1  15.88,13.08 90 top
D2  51.18,18.16 180 top
D5  15.88,8 0 top
H1  5.08,37.08 0 top
H2  59.94,36.7 0 top
H3  5.08,5.33 0 top
H4  81.28,5.33 0 top
IC1  74.93,26.92 0 top
IC2  29.21,29.46 0 top
IC3  54.74,28.96 0 top
IC4  13.46,17.02 90 top
J1  74.68,2.92 180 top
J2  15.24,0.25 180 top
JP3  55.88,39.62 180 top
JP4  55.88,2.79 180 top
LED1  10.79,16.13 0 top
LED2  8.38,16.26 0 top
LED3  50.67,30.73 270 top
PAD3  13.46,25.4 0 top
PAD4  13.46,29.97 0 top
PS1  15.24,16.76 90 bottom
PS2  54.99,27.3 90 bottom
Q1  11.81,12.45 90 top
Q2  59.31,7.11 0 top
Q3  56.01,24.38 90 top
R1  17.4,17.78 180 top
R2  6.73,26.04 0 top
R3  20.07,16 90 top
R4  11.68,37.85 0 top
R5  11.68,40 0 top
R6  8.38,11.81 270 top
R7  35.18,6.86 270 top
R8  12.32,20.7 270 top
R9  29.46,17.4 180 top
R10  22.48,30.99 270 top
R11  50.55,23.5 0 top
R12  24,12.7 180 top
R13  58.67,30.35 0 top
R14  50.55,25.91 0 top
R18  40.89,30.1 90 top
R26  37.72,30.23 180 top
R27  43.69,30.99 180 top
R28  23.24,25.27 90 top
R29  36.83,24.13 180 top
R30  36.83,26.42 180 top
R31  54.86,36.07 90 top
R32  43.05,35.81 90 top
R33  48.26,35.94 90 top
S1  1.91,17.14 270 top
S2  23.88,5.71 90 top
S3  31.37,5.71 90 top
SEL  2.29,29.72 270 top
U1  18.03,30.86 180 top
Y2  29.46,20.45 90 top

### Tracks (layer width: path | path; a pad name or v marks a point on that pad's centre or on a via)
1.8V
  Top 0.152: IC2.7 21.55,29.21 21.46,29.31 19.41,29.31 U1.5 18.68,28.65 C30.1 18.29,28.16 | C31.1 18.29,28.16 | C29.1 18.29,28.16
  Top 0.203: IC2.5 25,30.25 25.69,30.25 26.22,29.71 | IC2.31 29.46,29.71 | IC2.7 25,29.18 25.69,29.18 26.22,29.71 | 26.22,29.71 29.46,29.71 | IC2.24 31.86,25.32 31.86,26.07 29.46,28.47 29.46,29.71
3.3V  (via drill 0.35)
  Top 0.152: IC2.19 29.46,26.32 28.85,26.92 27.43,26.92 26.96,26.45 | IC2.14 26.96,26.45 | C2.1 5.88,24 R2.1 | 9.51,32 9.54,32 | 17.42,31.65 17.6,31.46 17.6,31.22 17.74,31.08 18.33,31.08 18.46,31.22 18.46,31.46 U1.1 20.66,29.71 22.48,29.71 | 17.42,31.65 U1.3 17.38,32.4 13.66,36.12 | 14.29,36.76 13.62,36.76 R4.2 | v16.13,31.62 17.4,31.62 17.42,31.65 | R30.1 37.97,26.42 v38.86,27.3 | IC2.32 34.81,30.21 v35.18,29.85 | R6.2 6.08,13.26 6.08,18.3 | R7.1 34.89,7.71 v33.66,6.48 | v25.02,25.53 25.94,26.45 26.96,26.45 | C8.1 63.25,30.31 v63.25,28.83
  Top 0.203: IC2.6 22.48,29.71 R10.2
  Top 0.508: IC1.2 67.05,33.15 67.02,33.19 65.99,33.19 64.52,31.71 C8.1 C9.1 64.26,34 64.26,38.49 61.62,41.13 18.67,41.13 14.29,36.76 13.66,36.12 9.54,32 | 9.51,32 C4.1 9.51,28.9 C1.1 9.69,26.54 9.69,25.91 6.9,23.11 C2.1 6.98,22.99 6.98,19.21 6.08,18.3 4.01,18.3 3.31,17.6 3.31,16.55 S1.2
  Bottom 0.152: v16.13,31.62 22.22,25.53 v25.02,25.53 26.8,27.3 36.83,27.3 | v38.86,27.3 36.83,27.3 | 36.83,27.3 35.18,28.96 v35.18,29.85 | v63.25,28.83 63.25,22.86 57.15,16.76 49.53,16.76 40.64,7.87 35.05,7.87 v33.66,6.48
AGND  (via drill 0.35)
  other vias: 24.77,35.56 24.51,39.75 33.02,35.56 46.74,37.08 40.39,35.18 35.31,34.92 41.91,33.27 50.67,29.85
  pour Top: 21.59,42.16 21.59,32.26 42.29,32.26 43.56,30.99 43.56,19.81 47.88,15.49 53.47,15.49 60.96,22.99 60.96,32 57.15,35.81 57.15,40.89 55.88,42.16
  pour Bottom: 21.59,42.16 21.59,32.26 42.29,32.26 43.56,30.99 43.56,19.94 48.01,15.49 53.34,15.49 60.96,23.11 60.96,37.08 55.88,42.16
BAT  (via drill 0.35)
  Top 0.152: R4.1 12.53,39.55 R5.2 12.79,40.26 v14.73,40.26 | v60.96,28.58 61.84,27.69 67.05,27.69 IC1.6
  Bottom 0.152: v14.73,40.26 20.83,34.16 55.25,34.16 60.71,28.7 60.83,28.7 v60.96,28.58
CS_63
  Top 0.152: IC2.23 31.45,24.52 31.75,24.23 34.44,24.23 35.56,23.11 38.1,23.11 38.1,23.08 38.71,22.48 38.71,19.97 46.1,12.57 50.13,12.57 63.09,25.53 IC1.8
DCS_63  (via drill 0.35)
  Top 0.152: IC2.13 25.62,24.38 v25.53,24.38 | IC1.9 62.75,24.26 v62.1,23.62
  Bottom 0.152: v62.1,23.62 62.1,26.42 56.58,31.94 44.64,31.94 36.45,23.75 26.16,23.75 v25.53,24.38
DGND  (via drill 0.35)
  other vias: 72.01,19.56 70.36,33.53 76.96,34.04 76.71,30.86 71.5,29.85 39.75,30.48 39.75,25.91 36.7,20.45 31.24,28.45 33.15,25.78 65.02,26.92 38.99,7.11 62.48,17.4 45.21,8 79.63,22.73 23.62,21.21 24,19.43 25.27,17.65 27.05,16.38 29.84,15.62 32.64,16.13 34.29,17.4 35.56,18.92 36.07,21.97 39.62,22.86 27.43,30.48 60.58,11.3 41.02,16.76 69.72,31.12 65.53,28.58 27.81,28.58
  pour Top: 21.59,31.75 41.91,31.75 42.55,31.12 42.55,18.67 48.26,12.95 53.34,12.95 62.23,21.84 62.23,34.54 87.63,34.54 87.63,0.25 24.13,0.25 24.13,18.03 21.59,20.57
  pour Bottom: 21.59,31.75 41.91,31.75 42.55,31.12 42.55,17.4 45.72,14.22 54.61,14.22 63.5,23.11 63.5,34.54 86.36,34.54 86.36,0.25 24.13,0.25 24.13,18.29 21.59,20.83
DREQ_63  (via drill 0.35)
  Top 0.152: IC2.8 22.11,28.71 21.59,28.19 21.59,24.38 23.11,22.86 v24,22.86 | v38.1,22.23 38.1,18.67 45.34,11.43 50.31,11.43 61.88,22.99 IC1.10
  Bottom 0.152: v24,22.86 24.38,23.24 37.08,23.24 v38.1,22.23
DTR
  Top 0.152: Q2.2 58.86,7.11 59.51,6.46 Q2.4 61.98,4.57 J1.6
GBUF_63
  Top 0.152: JP3.4 R33.2 48.11,36.79 47.13,35.81 42.02,35.81 40.75,37.08 30.61,37.08 29.46,35.94 IC2.42
GND  (via drill 0.35)
  other vias: 19.94,13.84 14.1,10.29 15.49,16.38 21.34,7.49 17.14,35.56 18.92,33.91
  pour Top: 0,0.25 0,42.16 20.32,42.16 20.32,19.3 22.86,16.76 22.86,0.25
  pour Bottom: 0,44.03 0,0.25 22.86,0.25 22.86,16.76 20.32,19.3 20.32,42.67
IO0  (via drill 0.35)
  Top 0.152: IC1.25 82.27,17.91 79.63,15.27 v79.63,15.24 | S2.2 23.88,5.59 v27.3,2.16 | v57.78,4.95 57.78,6.46 Q2.3
  Bottom 0.152: v79.63,15.24 72.52,8.13 70.48,8.13 67.31,4.95 v57.78,4.95 36.45,4.95 33.66,2.16 v27.3,2.16
IO13
  Top 0.152: IC1.16 58.81,15.37 46.23,2.79 JP4.5
IO14
  Top 0.152: IC1.13 61.47,19.18 47.37,5.08 45.47,5.08 JP4.6
IO15  (via drill 0.35)
  Top 0.152: SEL.2 1.31,28.7 1.31,30.37 1.59,30.65 4.5,30.65 6.74,32.89 8.51,32.89 v9.91,34.29 | IC1.23 82.67,15.37 v82.55,15.49
  Bottom 0.152: v9.91,34.29 9.91,37.97 13.12,41.19 44.16,41.19 44.45,40.89 61.94,40.89 64.13,38.7 64.13,35.18 67,32.31 67.13,32.31 67.44,32 83.82,32 85.09,30.73 85.09,18.03 v82.55,15.49
IO26
  Top 0.152: JP4.8 42.16,6.86 46.74,6.86 61.6,21.72 IC1.11
IO27
  Top 0.152: IC1.12 61.34,20.45 46.99,6.1 43.94,6.1 JP4.7
LEFT_63
  Top 0.152: JP3.5 45.72,39.33 R32.2 42.25,37.46 30.32,37.46 28.99,36.14 28.05,36.14 27.46,35.55 IC2.46
LINEIN_63  (via drill 0.35)
  Top 0.152: v26.42,35.81 26.46,35.77 IC2.48
  Bottom 0.152: v26.42,35.81 26.42,36.58 28.37,38.53 35.1,38.53 36.19,39.62 JP3.8
MICN_63
  Top 0.152: IC2.2 24.26,31.71 22.86,33.11 22.86,36.12 24.94,38.2 39.64,38.2 40.64,39.21 JP3.7
MICP_63
  Top 0.152: IC2.1 24.34,32.21 23.22,33.34 23.22,36.04 25,37.83 41.89,37.83 43.18,39.12 JP3.6
MISO  (via drill 0.35)
  Top 0.152: IC1.31 83.67,25.53 75.95,17.81 v75.95,15.49 | IC2.30 35.94,29.21 39.37,29.21 42.42,26.16 42.42,18.92 46.1,15.24 v49.78,15.24
  Bottom 0.152: v49.78,15.24 52.58,12.45 73.02,12.45 75.95,15.37 v75.95,15.49
MOSI  (via drill 0.35)
  Top 0.152: IC1.37 72.4,33.15 70.48,31.24 v70.48,25.27 | IC2.29 39.37,28.71 39.37,28.7 41.91,26.16 41.91,18.67 46.1,14.48 50.16,14.48 51.44,15.75 v52.2,15.75
  Bottom 0.152: v70.48,25.27 70.48,19.43 65.02,13.97 53.97,13.97 v52.2,15.75
N$1
  Bottom 0.508: PS1.3 7.93,18.73 3.49,18.73 S1.1
N$2  (via drill 0.35)
  Top 0.508: Q1.2 12.85,11.43 D1.1 15.99,11.54 C3.1 18.92,11.43 v17.91,10.41
  Bottom 0.508: PS1.1 17.91,13.35 v17.91,10.41
N$3
  Top 0.152: R6.1 LED2.A
N$4
  Top 0.508: IC4.1 11.96,15.72 LED1.C
N$5
  Top 0.508: R3.1 17.87,15.15 15.31,12.59 11.34,12.59 11.1,12.83 11.1,15.07 LED1.A
N$6
  Top 0.508: J2.1 13.98,5.07 13.98,5.82 16.16,8 D5.2
N$7
  Top 0.508: IC4.5 12.51,19.66 R8.2
N$8  (via drill 0.35)
  Top 0.305: D2.1 56.96,22.29 Q3.2 57.33,23.28 C13.1 57.64,25.91 v57.4,25.91
  Bottom 0.305: PS2.1 57.29,25.8 v57.4,25.91
N$9
  Top 0.152: C10.1 7.33,29.85 7.33,26.29 R2.2
N$10
  Top 0.152: SEL.1 5.5,29.72 C10.2
N$11
  Top 0.203: IC2.3 23.1,31.21 R10.1
N$12
  Top 0.152: R18.2 40.63,31.21 IC2.34
N$14
  Top 0.305: IC3.1 52.25,29.91 LED3.C
N$16
  Top 0.305: R14.1 49.7,26.33 48.84,27.19 48.84,29.65 LED3.A
N$17
  Bottom 0.508: S1.4 4.7,17.14 12.7,9.14 24.26,9.14 28.07,12.95 39.62,12.95 50.92,24.26 PS2.3
N$20
  Top 0.152: IC2.17 28.46,23.63 26.8,21.97 26.8,20.45 | 28.32,19.67 27.57,19.67 26.8,20.45 | 28.32,19.67 Y2.1 | C21.2 26.07,19.72 26.8,20.45 | R9.2 28.32,17.69 28.32,19.67
N$21
  Top 0.152: R27.1 44.21,30.99 42.98,32.21 IC2.36
N$22
  Top 0.203: R26.2 36.38,30.71 IC2.33
N$23
  Top 0.152: IC2.18 28.96,22.85 Y2.3 31.9,21.22 C22.2 31.33,17.4 R9.1
N$24
  Top 0.203: IC2.44 28.45,33.71 C23.1
N$25
  Top 0.203: IC2.25 35.98,24.18 R29.2
N$26
  Top 0.305: IC3.5 56.79,29.91 57.2,29.5 58.67,29.5 R13.2
N$27
  Top 0.152: R28.2 23.9,26.71 IC2.12
  Top 0.203: IC2.9 IC2.10 IC2.11 IC2.12
N$28
  Top 0.203: IC2.26 35.18,27.21 R30.2
N$30
  Top 0.152: R33.1 49.96,36.79 C26.1
N$31
  Top 0.152: C25.1 R32.1
N$32
  Top 0.152: R31.1 53.29,36.79 C24.1
RESET  (via drill 0.35)
  Top 0.152: R7.2 C7.1 34.74,4.21 33.53,4.21 31.37,6.37 S3.2 35.18,9.41 38.88,5.71 v39.12,5.71 | Q2.6 61.23,7.76 62.38,6.6 v67.18,6.6 | IC1.3 68.02,31.29 68.52,31.29 69.85,29.97 v69.85,11.68
  Bottom 0.152: v39.12,5.71 39.24,5.59 66.17,5.59 v67.18,6.6 69.85,9.27 v69.85,11.68
RIGHT_63  (via drill 0.35)
  Top 0.152: R31.2 53.33,38.46 52.86,38.46 51.69,39.62 JP3.3 | IC2.39 30.96,35.66 v31.11,35.81
  Bottom 0.152: JP3.3 49.4,38.23 41.27,38.23 39.75,36.7 32,36.7 v31.11,35.81
RTS
  Top 0.152: Q2.1 59.11,7.76 59.54,7.33 59.86,7.33 Q2.5 60.71,7.11 62.1,5.71 69.34,5.71 J1.2
RX  (via drill 0.35)
  Top 0.152: IC1.34 v82.56,29.34 v82.55,29.34
  Bottom 0.152: v82.55,29.34 82.42,29.21 82.42,25.02 81.66,24.26 81.66,14.61 74.04,6.98 71.12,6.98 J1.4
SCK  (via drill 0.35)
  Top 0.152: IC1.30 83.29,24.26 76.83,17.8 v76.83,17.53 | IC2.28 39.22,28.21 41.27,26.16 41.27,18.54 45.97,13.84 50.42,13.84 v51.56,14.99
  Bottom 0.152: v76.83,17.53 76.83,17.4 72.64,13.21 53.34,13.21 v51.56,14.99
SCL
  Top 0.152: IC1.36 82.05,31.88 80.52,30.35 80.52,26.09 73.74,19.3 73.74,11.73 71.28,9.27 56.77,9.27 53.34,5.84 JP4.2
SDA
  Top 0.152: JP4.1 55.88,6.6 57.91,8.64 71.75,8.64 74.68,11.56 74.68,19.05 83.7,28.07 IC1.33
TX  (via drill 0.35)
  Top 0.152: IC1.35 82.18,30.61 v81.79,30.23
  Bottom 0.152: J1.5 65.4,2.92 66.57,4.09 67.33,4.09 70.74,7.49 73.28,7.49 80.85,15.06 80.85,24.33 81.79,25.27 v81.79,30.23
V_BATT
  Top 0.508: PAD3.1 13.46,22.95 C6.1 13.73,20.42 13.73,17.62 14.41,16.94 IC4.3 14.41,14.67 13.29,13.55 Q1.3
V_USB  (via drill 0.35)
  Top 0.305: 17.78,9.36 22.29,9.36 23.25,10.32 41.82,10.32 v43.18,11.68 | C14.1 51.14,19.77 D2.2 v47.88,16.51 | C14.1 51.14,23.24 R11.2 R14.2 52.91,27.43 54.09,27.43 54.67,28.01 IC3.4 | Q3.1 52.35,20.57 C14.1
  Top 0.508: D5.1 13.35,9.36 C5.1 | C5.1 12.45,9.76 Q1.1 | IC4.4 16.01,18.32 R1.2 16.62,17.78 17.58,16.82 17.78,16.82 | 17.78,16.82 18.92,16.82 18.95,16.85 R3.2 20.07,16.78 21.02,15.82 21.02,12.27 18.11,9.36 17.78,9.36 C5.1 | D1.2 17.78,16.64 17.78,16.82
  Bottom 0.305: v47.88,16.51 47.88,16.38 v43.18,11.68
VBAT
  Top 0.305: Q3.3 56.01,25.78 57.15,26.92 56.87,27.21 56.87,28.41 56.69,28.59 54.6,28.59 54.02,28.01 IC3.3 51.97,28.01 C15.1 50.5,27.68 50.5,24.8 48.18,24.8 45.59,27.39 ABAT.1
VCCA  (via drill 0.35)
  Top 0.152: 28.97,32.99 29.22,32.74 31.2,32.74 31.47,33 IC2.38 31.58,33.58 31.58,32.87 31.72,32.74 32.2,32.74 35.79,36.32 C11.1 36.61,36.25 36.61,36.16 v37.59,35.18 38.61,34.16 48.12,34.16 C12.1 49.91,32.26 v48.77,31.12 | IC2.43 28.97,32.99 | IC2.45 28.08,33.58 28.08,32.87 28.21,32.74 28.7,32.74 28.95,32.99 28.97,32.99
  Bottom 0.152: JP3.2 51.56,37.85 41.4,37.85 38.73,35.18 v37.59,35.18
  Bottom 0.508: S1.5 11.27,8.28 21.66,8.28 21.68,8.25 24.51,8.25 28.45,12.19 39.88,12.19 50.58,22.9 53.31,22.9 53.55,23.14 53.55,25.37 52,26.92 50.93,26.92 48.77,29.08 v48.77,31.12
VOLPOT
  Top 0.152: IC1.7 68.02,26.21 68.52,26.21 69.17,25.57 69.17,11.15 68.27,10.25 55.33,10.25 48.26,3.17 JP4.4

### Text on the board
tSilk: charging | power | on/off | programming | boot | reset